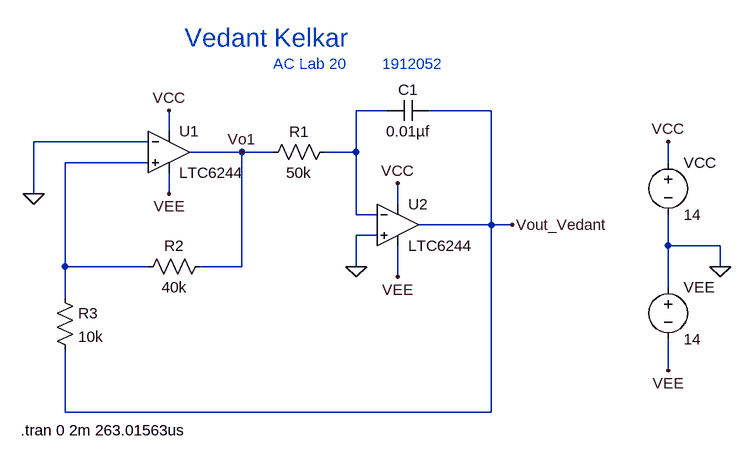
[diagram p0: schematic AC2_Lab20b.asc]
AC2_Lab20b.asc, the LTspice schematic file:
Version 4
SHEET 1 1012 680
WIRE 480 96 432 96
WIRE 640 96 544 96
WIRE 144 128 144 96
WIRE 112 144 -64 144
WIRE 256 160 176 160
WIRE 304 160 256 160
WIRE 432 160 432 96
WIRE 432 160 384 160
WIRE 112 176 -16 176
WIRE 912 176 912 144
WIRE -64 224 -64 144
WIRE 144 224 144 192
WIRE 496 240 496 208
WIRE 432 256 432 160
WIRE 464 256 432 256
WIRE 640 272 640 96
WIRE 640 272 528 272
WIRE 672 272 640 272
WIRE 464 288 432 288
WIRE 912 304 912 256
WIRE 992 304 912 304
WIRE -16 336 -16 176
WIRE 112 336 -16 336
WIRE 256 336 256 160
WIRE 256 336 192 336
WIRE 432 336 432 288
WIRE 992 336 992 304
WIRE 496 352 496 304
WIRE 912 368 912 304
WIRE -16 384 -16 336
WIRE 912 496 912 448
WIRE -16 560 -16 464
WIRE 640 560 640 272
WIRE 640 560 -16 560
FLAG 432 336 0
FLAG -64 224 0
FLAG 672 272 Vout_Vedant
FLAG 256 160 Vo1
FLAG 992 336 0
FLAG 912 144 VCC
FLAG 144 96 VCC
FLAG 496 208 VCC
FLAG 496 352 VEE
FLAG 144 224 VEE
FLAG 912 496 VEE
SYMBOL res 400 144 R90
WINDOW 0 0 56 VBottom 2
WINDOW 3 32 56 VTop 2
SYMATTR InstName R1
SYMATTR Value 50k
SYMBOL res 208 320 R90
WINDOW 0 0 56 VBottom 2
WINDOW 3 32 56 VTop 2
SYMATTR InstName R2
SYMATTR Value 40k
SYMBOL res -32 368 R0
SYMATTR InstName R3
SYMATTR Value 10k
SYMBOL cap 544 80 R90
WINDOW 0 0 32 VBottom 2
WINDOW 3 32 32 VTop 2
SYMATTR InstName C1
SYMATTR Value 0.01µf
SYMBOL voltage 912 160 R0
WINDOW 123 0 0 Left 0
WINDOW 39 0 0 Left 0
SYMATTR InstName VCC
SYMATTR Value 14
SYMBOL voltage 912 352 R0
WINDOW 123 0 0 Left 0
WINDOW 39 0 0 Left 0
SYMATTR InstName VEE
SYMATTR Value 14
SYMBOL OpAmps\\LTC6244 144 160 R0
SYMATTR InstName U1
SYMBOL OpAmps\\LTC6244 496 272 R0
SYMATTR InstName U2
TEXT 168 -16 Left 4 ;Vedant Kelkar
TEXT 304 24 Left 2 ;AC Lab 20        1912052
TEXT -84 588 Left 2 !.tran 0 2m 263.01563us

The netlist it stands for:
* AC2_Lab20b.asc
R1 N001 Vo1 50k
R2 Vo1 N002 40k
R3 N002 Vout_Vedant 10k
C1 Vout_Vedant N001 0.01µf
VCC VCC 0 14
VEE 0 VEE 14
XU1 N002 0 VCC VEE Vo1 LTC6244  ; pins In+ In- V+ V- OUT
XU2 0 N001 VCC VEE Vout_Vedant LTC6244  ; pins In+ In- V+ V- OUT
* Vedant Kelkar
* AC Lab 20        1912052
.tran 0 2m 263.01563us
.backanno
.end